# EasyEDA Pro project ProPrj_FOC_TEST_2025-02-24.epro, board PCB1
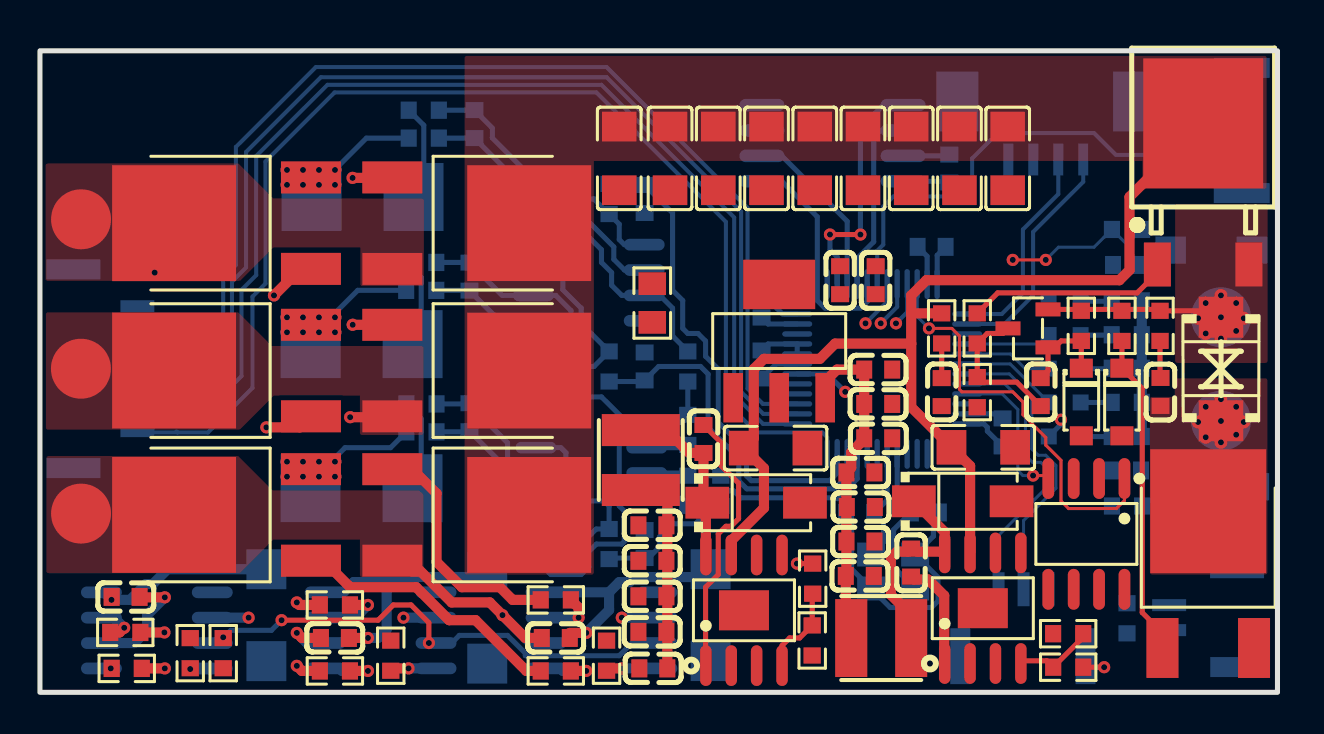
[diagram p6: board, top side]
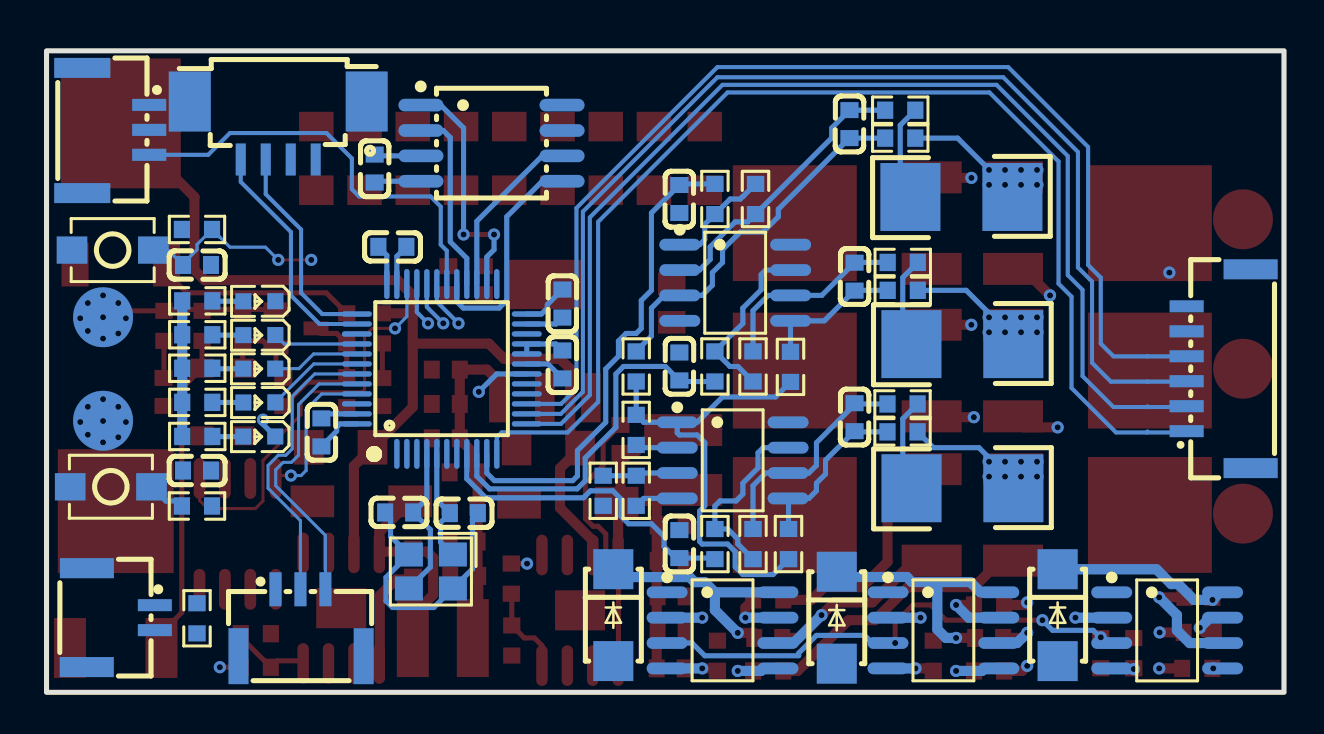
[diagram p7: board, bottom side, seen from below]

Outline 61.9 x 32.11 mm; copper layers: Top Layer, Inner1, Inner2, Bottom Layer. Coordinates in mm from the lower left corner of the outline.
Outline path: rectangle 0,32.11 61.9,0
Stack: Top Layer 0.035mm 外层铜厚1oz / Dielectric1 0.2104mm 7628 RC49% 8.6mil / Inner1 0.0152mm 内层铜厚 / Dielectric2 1.065mm 1.1mm H/HOZ 含铜 / Inner2 0.0152mm 内层铜厚 / Dielectric3 0.2104mm 7628 RC49% 8.6mil / Bottom Layer 0.035mm 外层铜厚1oz

## Design rules (mm)
template: 自定义配置
spacing copperThickness1oz (default): track to track 0.102, other pairs 0.152 to 0.3
spacing copperThickness2oz: track to track 0.203, other pairs 0.152 to 0.3
track width copperThickness1oz (default): min 0.127, default 0.254, max 5.08
track width copperThickness2oz: min 0.203, default 0.254, max 2.54
differential pair differentialPair (default): width min 0.127, default 0.254, max 2.54; gap min 0.152, default 0.152
via viaSize (default): diameter min 0.5, default 0.61, max 10; hole min 0.3, default 0.305, max 6.299

## Placement (name value [footprint] x y rotation side)
C9  100nF  [C0603]  41.93 16.15 0 top
C10  100nF  [C0603]  40.03 20.63 90 top
C11  10uF  [C0603]  41.93 14.43 0 top
C12  10uF  [C0603]  41.81 20.63 90 top
C13  10uF  [C1206]  47.19 12.26 180 top
C14  10uF  [C1206]  36.8 12.22 180 top
C15  10uF  [C0603]  30.68 1.2 0 top
C16  10uF  [C0603]  30.64 3.03 0 top
C17  10uF  [C0603]  30.64 4.8 0 top
C18  10uF  [C0603]  30.64 6.58 0 top
C19  10uF  [C0603]  30.64 8.36 0 top
C20  10uF  [C0603]  41.01 5.83 180 top
C21  10uF  [C0603]  41.04 7.55 180 top
C22  10uF  [C0603]  41.06 9.28 180 top
C23  10uF  [C0603]  41.04 11.01 180 top
C24  10uF  [C0603]  41.93 12.72 180 top
C28  100nF  [C0603]  54.38 21.39 0 bottom
C43  6pF  [C0603]  44.27 9 180 bottom
C44  100nF  [C0603]  44.61 22.3 0 bottom
C45  100nF  [C0603]  48.16 13.01 270 bottom
C48  6pF  [C0603]  41.03 8.97 0 bottom
C52  100nF  [C0603]  36.1 16.41 90 bottom
C54  100nF  [C0603]  54.38 11.1 0 bottom
C55  100nF  [C0603]  45.49 26.22 90 bottom
C56  4.7uF  [C0603]  25.8 2.72 0 top
C57  4.7uF  [C0603]  14.75 2.72 0 top
C58  4.7uF  [C0603]  4.28 4.77 180 top
C59  1uF  [C0603]  30.25 7.42 270 bottom
C60  1uF  [C0603]  30.25 16.31 270 bottom
C61  1uF  [C0603]  30.25 24.69 90 bottom
C62  47uF  [C1206]  48.41 26.72 90 top
C63  47uF  [C1206]  28.98 26.72 90 top
C64  47uF  [C1206]  31.52 26.72 90 top
C65  47uF  [C1206]  33.93 26.72 90 top
C66  47uF  [C1206]  36.34 26.72 90 top
C67  47uF  [C1206]  38.76 26.72 90 top
C68  47uF  [C1206]  41.17 26.72 90 top
C69  47uF  [C1206]  43.58 26.72 90 top
C70  47uF  [C1206]  46 26.72 90 top
C74  6pF  [C0603]  21.49 13.77 270 bottom
C75  6pF  [C0603]  21.49 20.81 270 bottom
C76  6pF  [C0603]  21.74 28.44 270 bottom
C78  1uF  [C0603]  45.11 15.03 270 top
C79  100nF  [C0603]  33.19 12.68 270 top
C80  100nF  [C0603]  43.58 6.49 90 top
C81  1uF  [C0603]  56.05 15.04 90 top
C82  100nF  [C0603]  50.06 15.03 270 top
C83  100nF  [C0603]  36.1 19.46 90 bottom
CN1  -  [CONN-SMD_1.25-4PWT]  50.31 28.12 180 bottom
D1  -  [SMB_L4.6-W3.6-LS5.3-BI]  59.08 16.18 90 top
D5  -  [SMA_L4.3-W2.5-LS5.0-FD]  46.16 9.56 180 top
D6  -  [DO-214AC_L4.3-W2.7-LS5.3-RD]  33.55 3.86 270 bottom
D7  -  [DO-214AC_L4.3-W2.7-LS5.3-RD]  22.37 3.73 270 bottom
D8  -  [DO-214AC_L4.3-W2.7-LS5.3-RD]  11.33 3.86 270 bottom
D9  -  [SMA_L4.3-W2.5-LS5.0-FD]  35.83 9.49 180 top
L2  15uH  [IND-SMD_L4.0-W4.0_FNR40XXS]  42.08 2.71 180 top
L3  15uH  [IND-SMD_L4.0-W4.0_FNR40XXS]  30.06 11.63 270 top
LED1  -  [LED_0603]  51.31 14.5 0 bottom
LED2  -  [LED_0603]  51.31 16.19 0 bottom
LED3  -  [LED_0603]  51.31 17.87 0 bottom
LED4  -  [LED_0603]  51.31 12.8 0 bottom
LED5  -  [LED_0603]  51.31 19.57 0 bottom
NOREF  -  [Pad_e4786]  2.05 8.94 0 top
NOREF#2  -  [Pad_e4785]  2.05 16.2 0 top
NOREF#3  -  [Pad_e793]  59.08 13.59 0 top
NOREF#4  -  [Pad_e4783]  2.05 23.68 0 top
NOREF#5  -  [Pad_e794]  59.08 18.77 0 top
Q3  -  [SOT-23-3_L2.9-W1.3-P1.90-LS2.4-BR]  49.43 18.22 0 top
Q5  -  [TO-252-2_L6.6-W6.1-P4.57-LS9.9-BR-CW]  58.44 5.64 270 top
Q6  -  [TO-252-2_L6.6-W6.1-P4.57-LS9.9-BR-CW]  21.05 8.88 180 top
Q7  -  [TO-252-2_L6.6-W6.1-P4.57-LS9.9-BR-CW]  21.05 16.1 180 top
Q8  -  [TO-252-2_L6.6-W6.1-P4.57-LS9.9-BR-CW]  21.05 23.48 180 top
Q9  -  [TO-252-2_L6.6-W6.1-P4.57-LS9.9-BR-CW]  10.13 8.88 0 top
Q10  -  [TO-252-2_L6.6-W6.1-P4.57-LS9.9-BR-CW]  10.13 16.1 0 top
Q11  -  [TO-252-2_L6.6-W6.1-P4.57-LS9.9-BR-CW]  10.13 23.48 0 top
Q13  IRFR5410TRPBF  [TO-252-2_L6.5-W6.1-P4.58-LS10.0-TR]  58.19 24.95 180 top
R1  22R  [R0603]  56.03 18.34 90 top
R4  22Ω  [R0603]  45.11 18.22 90 top
R13  10K  [R0603]  46.89 15.03 90 top
R15  0Ω  [R0805]  30.63 19.49 270 top
R19  12K  [R0603]  38.65 5.69 90 top
R20  5.1K  [R0603]  51.44 1.26 0 top
R21  1.5K  [R0603]  38.63 2.59 90 top
R22  1.5K  [R0603]  51.43 2.93 0 top
R30  120R  [R0603]  54.38 3.7 90 bottom
R31  10K  [R0603]  54.38 9.33 0 bottom
R32  10kΩ  [r0603]  54.38 23.17 0 bottom
R40  10K  [R0603]  34.06 10.09 270 bottom
R41  1K  [R0603]  19.08 14.43 180 bottom
R42  1K  [R0603]  19.08 13.04 180 bottom
R43  1K  [R0603]  19.07 21.52 180 bottom
R44  1K  [R0603]  19.07 20.12 180 bottom
R45  1K  [R0603]  19.2 29.14 180 bottom
R46  1K  [R0603]  19.2 27.74 180 bottom
R47  10R  [R0603]  14.75 4.37 180 top
R48  0R  [R0603]  17.55 1.83 270 top
R49  10R  [R0603]  14.75 1.07 180 top
R50  10K  [R0603]  32.41 10.09 90 bottom
R51  36.5K  [R0603]  26.57 7.42 90 bottom
R52  36.5K  [R0603]  24.79 7.42 90 bottom
R53  36.5K  [R0603]  26.57 16.31 90 bottom
R54  36.5K  [R0603]  24.69 16.29 90 bottom
R55  36.5K  [R0603]  26.44 24.69 270 bottom
R56  36.5K  [R0603]  32.41 16.31 90 bottom
R57  10K  [R0603]  32.41 13.14 90 bottom
R59  100R  [R0603]  28.47 7.42 90 bottom
R60  100R  [R0603]  28.47 16.31 90 bottom
R61  100R  [R0603]  28.47 24.69 270 bottom
R62  10R  [R0603]  4.27 3 0 top
R63  0R  [R0603]  7.52 1.96 270 top
R64  10R  [R0603]  4.34 1.2 0 top
R65  10K  [R0603]  9.17 1.96 90 top
R155  10K  [R0603]  54.37 14.51 180 bottom
R156  10K  [R0603]  54.37 16.22 180 bottom
R157  10K  [R0603]  54.37 17.9 180 bottom
R158  10K  [R0603]  54.37 12.81 180 bottom
R159  10K  [R0603]  54.37 19.59 180 bottom
R160  10R  [R0603]  25.8 4.63 180 top
R161  10R  [R0603]  25.8 1.07 180 top
R162  2mΩ  [RES-SMD_L6.4-W3.2-A]  16.09 10.21 180 bottom
R163  2mΩ  [RES-SMD_L6.4-W3.2-A]  16.09 17.43 180 bottom
R164  2mΩ  [RES-SMD_L6.4-W3.2-A]  16.14 24.79 180 bottom
R165  0R  [R0603]  28.34 1.83 270 top
R166  100K  [R0603]  54.12 18.34 90 top
R167  100K  [R0603]  52.09 18.34 90 top
R168  1K  [R0603]  46.89 18.22 90 top
SW3  轻触按键3*4*H  [SW-SMD_L4.0-W2.9-LS5.0]  58.6 22.14 0 bottom
SW4  轻触按键3*4*H  [SW-SMD_L4.0-W2.9-LS5.0]  58.69 10.29 180 bottom
U3  -  [SOIC-8_L5.0-W4.0-P1.27-LS6.0-BL-EP2.0]  35.22 4.1 0 top
U4  -  [SOIC-8_L5.0-W4.0-P1.27-LS6.0-BL-EP2.0]  47.16 4.21 0 top
U5  -  [SOT-223-4_L6.5-W3.5-P2.30-LS7.0-BR]  36.98 17.58 270 top
U12  -  [LQFP-48_L7.0-W7.0-P0.50-LS9.0-BL]  42.13 16.19 180 bottom
U13  -  [CONN-SMD_6P-P1.25_GH1.25-6PWBPZ]  3.27 16.2 90 bottom
U17  SN65HVD230DR  [SOIC-8_L4.9-W3.9-P1.27-LS6.0-BL]  52.35 7.93 180 top
U18  -  [SOIC-8_L5.2-W5.2-P1.27-LS7.9-BL]  39.65 27.49 270 bottom
U19  -  [SOIC-8_L4.9-W3.9-P1.27-LS6.0-BL]  27.45 20.5 270 bottom
U20  -  [SOIC-8_L4.9-W3.9-P1.27-LS6.0-BL]  28.09 3.1 270 bottom
U21  -  [SOIC-8_L4.9-W3.9-P1.27-LS6.0-BL]  17.04 3.1 270 bottom
U22  -  [SOIC-8_L4.9-W3.9-P1.27-LS6.0-BL]  5.85 3.1 270 bottom
U23  -  [SOIC-8_L4.9-W3.9-P1.27-LS6.0-BL]  27.58 11.61 270 bottom
U24  GH1.25-2P卧贴  [CONN-SMD_2P-P1.25_GH1.25-2PWBPZ]  58.19 3.74 270 bottom
U25  GH1.25-3P卧贴  [CONN-SMD_GH1.25-3P]  49.17 3.48 180 bottom
U26  GH1.25-3P卧贴  [CONN-SMD_GH1.25-3P]  58.44 28.12 270 bottom
X1  8MHz  [CRYSTAL-SMD_4P-L3.2-W2.5-BL]  42.68 6.05 0 bottom
ZD1  MMSZ5239B  [SOD-123_L2.8-W1.8-LS3.7-RD]  54.12 14.53 270 top
ZD2  MMSZ5239B  [SOD-123_L2.8-W1.8-LS3.7-RD]  52.09 14.53 270 top

## Footprints (pads in the part's own frame, mm; a bottom-side part is the same pattern mirrored in y, then rotated)
C0603
  rect 0.8x0.9 smd: 1(-0.7,0) 2(0.7,0)
C1206
  rect 1.485x1.728 smd: 1(-1.593,0) 2(1.593,0)
CONN-SMD_1.25-4PWT
  rect 0.5x1.6 smd: 1(1.875,-1.45) 2(0.625,-1.45) 3(-0.625,-1.45) 4(-1.875,-1.45)
  rect 2.1x2.999 smd: 5(4.425,1.45) 6(-4.425,1.45)
CONN-SMD_2P-P1.25_GH1.25-2PWBPZ
  rect 0.6x1.7 smd: 1(-0.625,1.702) 2(0.625,1.702)
  rect 1.001x2.7 smd: 3(-2.474,-1.696) 4(2.474,-1.702)
CONN-SMD_6P-P1.25_GH1.25-6PWBPZ
  rect 0.6x1.7 smd: 1(-3.125,1.6) 2(-1.875,1.6) 3(-0.625,1.6) 4(0.625,1.6) 5(1.875,1.6) 6(3.125,1.6)
  rect 1x2.7 smd: 7(-4.975,-1.6) 8(4.975,-1.6)
CONN-SMD_GH1.25-3P
  rect 0.6x1.7 smd: 1(-1.282,1.675) 2(-0.032,1.675) 3(1.218,1.675)
  rect 1x2.8 smd: 4(-3.132,-1.675) 5(3.132,-1.675)
CRYSTAL-SMD_4P-L3.2-W2.5-BL
  rect 1.4x1.2 smd: 1(-1.1,-0.85) 2(1.1,-0.85) 3(1.1,0.85) 4(-1.1,0.85)
DO-214AC_L4.3-W2.7-LS5.3-RD
  rect 1.999x1.999 smd: 1(-2.299,0) 2(2.301,0)
IND-SMD_L4.0-W4.0_FNR40XXS
  rect 1.6x3.9 smd: 1(-1.5,0) 2(1.5,0)
LED_0603
  rect 0.8x0.8 smd: 1(-0.851,-0.01) 2(0.75,-0.005)
LQFP-48_L7.0-W7.0-P0.50-LS9.0-BL
  oval 0.27x1.5 smd: 2(-2.25,-4.25) 3(-1.75,-4.25) 4(-1.25,-4.25) 5(-0.75,-4.25) 6(-0.25,-4.25) 7(0.25,-4.25) 8(0.75,-4.25) 9(1.25,-4.25) 10(1.75,-4.25) 11(2.25,-4.25) 12(2.75,-4.25) 25(2.75,4.25) 26(2.25,4.25) 27(1.75,4.25) 28(1.25,4.25) 29(0.75,4.25) 30(0.25,4.25) 31(-0.25,4.25) 32(-0.75,4.25) 33(-1.25,4.25) 34(-1.75,4.25) 35(-2.25,4.25) 36(-2.75,4.25)
  oval 1.5x0.27 smd: 13(4.25,-2.75) 14(4.25,-2.25) 15(4.25,-1.75) 16(4.25,-1.25) 17(4.25,-0.75) 18(4.25,-0.25) 19(4.25,0.25) 20(4.25,0.75) 21(4.25,1.25) 22(4.25,1.75) 23(4.25,2.25) 24(4.25,2.75) 37(-4.25,2.75) 38(-4.25,2.25) 39(-4.25,1.75) 40(-4.25,1.25) 41(-4.25,0.75) 42(-4.25,0.25) 43(-4.25,-0.25) 44(-4.25,-0.75) 45(-4.25,-1.25) 46(-4.25,-1.75) 47(-4.25,-2.25) 48(-4.25,-2.75)
Pad_e793
  round 3 smd far side: 1(0,0)
Pad_e794
  round 3 smd far side: 1(0,0)
Pad_e4783
  round 3 smd: 1(0,0)
Pad_e4785
  round 3 smd: 1(0,0)
Pad_e4786
  round 3 smd: 1(0,0)
R0603
  rect 0.806x0.864 smd: 1(-0.753,0) 2(0.753,0)
r0603
  rect 0.806x0.864 smd: 1(-0.753,0) 2(0.753,0)
R0805
  rect 1.133x1.377 smd: 1(-0.966,0) 2(0.966,0)
RES-SMD_L6.4-W3.2-A
  rect 2.999x3.401 smd: 1(-2.55,0) 2(2.55,0)
SMA_L4.3-W2.5-LS5.0-FD
  rect 2.184x1.593 smd: 1(-2.443,0) 2(2.443,0)
SMB_L4.6-W3.6-LS5.3-BI
  rect 2.047x2.24 smd: 1(-2.591,0) 2(2.591,0)
SOD-123_L2.8-W1.8-LS3.7-RD
  rect 0.95x1.15 smd: 1(-1.692,0) 2(1.692,0)
SOIC-8_L4.9-W3.9-P1.27-LS6.0-BL
  oval 0.588x2.045 smd: 1(-1.905,-2.772) 2(-0.635,-2.772) 3(0.635,-2.772) 4(1.905,-2.772) 5(1.905,2.772) 6(0.635,2.772) 7(-0.635,2.772) 8(-1.905,2.772)
SOIC-8_L5.0-W4.0-P1.27-LS6.0-BL-EP2.0
  oval 0.574x2.037 smd: 1(-1.905,-2.768) 2(-0.635,-2.768) 3(0.635,-2.768) 4(1.905,-2.768) 5(1.905,2.768) 6(0.635,2.768) 7(-0.635,2.768) 8(-1.905,2.768)
  rect 2.5x2 smd: 9(0,0)
SOIC-8_L5.2-W5.2-P1.27-LS7.9-BL
  oval 0.63x2.25 smd: 1(-1.905,-3.53) 2(-0.635,-3.53) 3(0.635,-3.53) 4(1.905,-3.53) 5(1.905,3.53) 6(0.635,3.53) 7(-0.635,3.53) 8(-1.905,3.53)
SOT-23-3_L2.9-W1.3-P1.90-LS2.4-BR
  rect 1.25x0.701 smd: 1(1.001,-0.95) 2(1.001,0.95) 3(-1.001,0)
SOT-223-4_L6.5-W3.5-P2.30-LS7.0-BR
  rect 2.47x0.98 smd: 1(2.835,-2.3) 2(2.835,0) 3(2.835,2.3)
  rect 2.47x3.6 smd: 4(-2.835,0)
SW-SMD_L4.0-W2.9-LS5.0
  rect 1.53x1.36 smd: 1(-2.035,0) 2(2.035,0)
TO-252-2_L6.5-W6.1-P4.58-LS10.0-TR
  rect 1.35x2.2 smd: 1(2.29,3.533) 3(-2.29,3.533)
  rect 6x6.5 smd: 4(0,-3.533)
TO-252-2_L6.6-W6.1-P4.57-LS9.9-BR-CW
  rect 3x1.6 smd: 1(3.424,-2.29) 3(3.424,2.29)
  rect 6.2x5.8 smd: 2(-3.424,0)

## Nets
As in the schematic, except:
5V: C9.1 C11.1 C20.2 C21.2 C22.2 C23.2 C24.2 C54.1 L2.2 R20.2 U5.3 U17.3 U26.2
11V: C15.2 C16.2 C17.2 C18.2 C19.2 D6.2 D7.2 D8.2 L3.2 R19.2 U20.1 U21.1 U22.1
GROUND: C81.1 D1.1 NOREF#3.1 Q5.2
POWER: D1.2 NOREF#5.1 Q3.2 Q13.3 R1.2 R166.2 R167.2
U: C56.1 NOREF.1 Q6.3 Q9.2 U20.6
V: C57.1 NOREF#2.1 Q7.3 Q10.2 U21.6
W: C58.1 NOREF#4.1 Q8.3 Q11.2 U22.6
$2N13950: C80.2 D5.2 L2.1 U4.8
$2N13958: C79.2 D9.2 L3.1 U3.8

Pads without a net: U3 2 3 5; U4 2 3 5; U5 2; U12 2 3 4 8 16 17 39 46; U17 5

## Via types
v1: diameter 0.61, hole 0.305, Top Layer to Bottom Layer, 44 vias
v2: diameter 0.65, hole 0.3, Top Layer to Bottom Layer, 42 vias

## Routing (per net, layer and track width the routed paths; a pad name or vN(x,y) marks a point on that pad's centre or on a via; arc(x,y) is an arc through that point)
3.3V: length 18.3
  Bottom Layer w0.254: U12.36 44.88,21.87 C44.2 ; C45.2 47.39,13.07 47.39,13.26 47.22,13.44 U12.48 ; U12.24 37.15,18.94 36.85,19.23 36.85,19.41 C83.2 ; U12.20 U12.21 36.42,17.44 C52.2 ; U18.3 45.42,26.85 C55.2
  Bottom Layer w0.508: R158.1 55.12,12.81 55.12,19.59 R159.1
5V: length 18
  Top Layer w0.254: 52.19,1.26 v1(53.24,1.26)
  Top Layer w0.508: U5.3 39.28,15.56 39.87,16.15 C9.1 C11.1 C24.2 41.23,12.67 40.58,12.01 40.58,11.24 C23.2 C21.2 40.34,5.86 C20.2 40.31,2.99 L2.2
5V-FD: length 4.1
  Top Layer w0.254: R22.2 52.19,2.76 R20.1 50.36,1.58 49.21,1.58 U4.4
11V: length 11
  Top Layer w0.254: R19.2 v1(37.87,6.44)
  Top Layer w0.508: 31.39,9.2 31.39,10.13 30.06,10.13 ; C15.2 31.38,9.19
12V-FD: length 4.5
  Top Layer w0.254: R19.1 38.63,4.91 R21.2 38,2.72 37.5,2.72 37.12,2.34 U3.4
24V-CALC-OUT: length 55
  Top Layer w0.508: R4.2 43.6,18.97 43.58,18.99 ; 43.58,17.45 43.58,18.99 ; 43.58,17.45 39.77,17.45 39.01,16.69 36.22,16.69 35.71,16.18 35.71,12.73 C14.2 36.22,11.21 36.22,9.23 34.58,7.59 U3.7 ; 43.58,17.45 43.58,14.28 C13.2 46.53,11.33 U4.7 ; 43.58,18.99 43.58,19.87 44.35,20.63 54,20.63 54.51,21.14 54.51,24.8 Q13.4
AGND: length 2.2
  Bottom Layer w0.254: R50.1 32.03,9.71 U23.4
V1: length 19.7
  Top Layer w0.508: v1(15.64,18.4) 17.62,18.4 ; v1(12.85,4.5) 12.98,4.37 R47.2
  Inner1 w0.508: v1(12.85,4.5) 13.61,4.5 15.64,6.53 15.64,11.76 14.37,13.03 14.37,16.11 15.64,17.38 v1(15.64,18.4)
V2: length 16.3
  Top Layer w0.508: R49.2 13.1,1.07 v1(12.85,1.32) ; v1(11.33,13.26) 13,13.26 Q10.1
  Inner1 w0.508: v1(11.33,13.26) 11.33,2.85 v1(12.85,1.32)
ADC-U: length 16.5
  Bottom Layer w0.254: U12.9 40.88,10.69 39.89,9.69 39.85,9.74 35.04,9.74 34.69,10.09 33.58,10.09 33.17,9.68 33.17,8.82 32.79,8.44 31.65,8.44 31.01,7.8 31.01,7.29 30.44,6.72 C59.2 28.52,6.72 R59.1
ADC-V: length 18.4
  Bottom Layer w0.254: U12.10 40.38,10.82 39.74,10.18 35.36,10.18 34.96,10.58 34.96,11.73 33.42,13.26 33.42,15.93 33.04,16.31 30.95,16.31 30.2,15.56 R60.1
ADC-W: length 24.5
  Bottom Layer w0.254: U12.11 39.88,10.98 39.5,10.6 35.58,10.6 35.35,10.83 35.35,12.1 33.93,13.52 33.93,16.18 33.3,16.82 33.3,17.58 32.92,17.96 32.41,17.96 32.15,18.22 32.15,19.61 31.65,20.12 31.65,24 C61.2 30.2,25.45 R61.1
D-GND: length 38
  Bottom Layer w0.254: C45.1 47.93,13.94 U12.47 ; 18.63,24.95 19.2,25.51 19.2,28.38 R45.2 ; R43.2 19.07,20.76 19.07,17.9 18.5,17.34 ; C43.1 44.7,8.73 44.7,7.81 X1.2 44.92,5.75 44.92,4.57 44.6,4.25 42.53,4.25 X1.4 40.6,6.18 40.6,8.7 C48.1 ; U18.4 45.42,25.58 C55.1 ; U12.19 36.83,16.44 C52.1 ; C44.1 44.38,21.82 U12.35 ; R41.2 19.07,13.69 19.07,10.71 18.57,10.21 ; C83.1 36.42,18.44 U12.23
FDCAN-RX: length 7.6
  Top Layer w0.152: v1(49.68,10.85) 50.29,10.85 U17.4
  Bottom Layer w0.152: U12.45 48.14,14.94 48.92,14.16 48.92,11.1 49.17,10.85 v1(49.68,10.85)
FDCAN-TX: length 20.6
  Top Layer w0.152: U17.1 54.25,9.6 53.85,9.2 51.46,9.2 51.08,9.58 51.08,11.61 50.31,12.37 50.31,12.75 49.17,13.9 49.17,14.53 48.66,15.04 46.12,15.04 46,15.17 46,17.83 45.62,18.22 v1(44.47,18.22)
  Bottom Layer w0.152: U12.34 43.88,18.81 v1(44.47,18.22)
GROUND:
  vias: v2(57.93,13.53) v2(58.32,14.29) v2(58.32,12.77) v2(59.08,14.67) v2(59.08,13.58) v2(59.08,12.51) v2(59.84,14.29) v2(59.84,12.89) v2(60.22,13.53)
I-VREF: length 23.4
  Bottom Layer w0.254: R54.1 25.44,14.79 28.09,14.79 29.36,13.52 U23.1 ; R56.1 R57.2 32.03,13.52 U23.1 ; U23.1 30.35,12.99 30.25,12.88 29.36,12.88 28.98,12.5 28.98,9.33 29.23,9.07 29.23,7.55 29.11,7.42 27.84,7.42 27.45,7.04 27.45,6.28 27.07,5.9 25.56,5.9 R52.1
LED0: length 4.9
  Bottom Layer w0.152: LED1.1 48.54,16.44 U12.42
LED1: length 4.4
  Bottom Layer w0.152: 50.46,16.2 49.28,16.2 48.55,16.94 U12.41
LED2: length 4.3
  Bottom Layer w0.152: LED3.1 50.01,17.44 U12.40
LED-WARNING: length 15.2
  Inner1 w0.254: v1(51.08,13.64) 41.68,13.64 v1(40.28,15.04)
  Bottom Layer w0.254: v1(51.08,13.64) 51.08,13.42 LED4.1 ; U12.18 39.39,15.94 v1(40.28,15.04)
MOTOR_CSN: length 25
  Top Layer w0.254: v1(12.09,3.61) 16.91,3.61 17.68,4.37 18.56,4.37 19.45,3.48 v1(19.45,2.47)
  Bottom Layer w0.254: U20.3 29.61,2.47 28.98,1.83 24.28,1.83 24.28,1.96 23.39,2.85 20.98,2.85 20.6,2.47 U21.3 ; v1(12.09,3.61) 11.58,3.1 9.55,3.1 9.2,2.75 v1(9.17,2.75)
  Bottom Layer w0.508: 9.17,2.72 8.91,2.46 U22.3
NRST: length 9.8
  Top Layer w0.152: v1(48.66,21.64) v1(50.31,21.64)
  Bottom Layer w0.152: v1(50.31,21.64) 50.95,22.28 52.73,22.28 53.24,22.79 53.24,22.79 R32.1 54.38,22.41 54.38,22.15 55.08,21.45 C28.2 55.82,22.14 SW3.1
OSC+: length 7.8
  Bottom Layer w0.254: U12.5 42.88,9.69 C43.2 42.7,8.14 42.7,6.27 X1.3
OSC-: length 5.8
  Bottom Layer w0.254: U12.6 42.38,9.62 41.73,8.97 42.2,8.5 42.2,7.52 X1.1
POWER: length 8.8
  Top Layer w0.254: Q3.2 55.96,19.17 R1.2 58.76,19.1 v2(59.08,18.77)
  vias: v2(57.93,18.72) v2(58.32,19.49) v2(58.32,17.96) v2(59.08,19.87) v2(59.08,17.71) v2(59.84,19.49) v2(59.84,18.09) v2(60.22,18.72)
PWM-U: length 29.6
  Inner1 w0.508: v1(29.11,3.74) 29.11,12.75 33.04,16.69 41.93,16.69 42.82,17.58 v1(42.82,18.47)
  Bottom Layer w0.203: U12.33 43.38,19.03 v1(42.82,18.47)
  Bottom Layer w0.508: U20.2 v1(29.11,3.74)
PWM-V: length 36.7
  Inner1 w0.508: v1(42.06,18.47) 42.06,17.91 41.6,17.45 32.53,17.45 28.25,13.17 28.25,9.99 26.44,8.18 21.61,8.18 18.18,4.75 v1(18.18,3.74)
  Bottom Layer w0.203: U12.32 42.88,19.29 v1(42.06,18.47)
  Bottom Layer w0.508: v1(18.18,3.74) U21.2
PWM-W: length 48
  Inner1 w0.508: v1(10.44,3.74) 10.44,2.34 12.21,0.56 13.87,0.56 14.63,1.32 14.63,2.47 15.64,3.48 16.79,3.48 17.39,4.08 17.39,5.48 21.01,9.11 25.84,9.11 27.2,10.47 27.2,13.64 32.03,18.47 v1(41.3,18.47)
  Bottom Layer w0.203: U12.31 42.38,19.55 v1(41.3,18.47)
  Bottom Layer w0.508: v1(10.44,3.74) 10.43,3.73 U22.2
SPI1-CLK: length 58
  Bottom Layer w0.203: U12.13 36.17,13.44 34.73,14.88 34.73,23.77 28.09,30.41 14.38,30.41 10.82,26.84 10.82,20.88 10.08,20.14 10.08,15.83 8.53,14.28 6.86,14.28 ; U13.2 4.91,14.28 6.86,14.28 ; 6.86,14.28 6.83,14.31
SPI1-CSN: length 61.2
  Bottom Layer w0.203: U13.1 4.93,13.01 6.88,13.01 ; U12.12 39.38,12.77 39.14,13.01 35.84,13.01 34.31,14.53 34.31,23.55 27.84,30.03 14.74,30.03 11.28,26.57 11.28,20.46 10.63,19.81 10.63,15.23 8.4,13.01 6.88,13.01 ; 6.83,13.06 6.88,13.01
SPI1-MISO: length 57.4
  Bottom Layer w0.203: 6.84,15.55 8.66,15.55 9.6,16.49 9.6,20.56 10.31,21.26 10.31,27.05 14.05,30.79 28.34,30.79 35.07,24.06 35.07,15.04 36.18,13.94 U12.14 ; 6.84,15.55 6.83,15.56 ; 6.84,15.55 4.89,15.55 U13.3
SPI1-MOSI: length 56.7
  Bottom Layer w0.203: U13.4 4.87,16.82 6.84,16.82 ; 6.84,16.82 8.53,16.82 9.17,17.45 9.17,20.76 9.8,21.39 9.8,27.3 13.8,31.3 28.34,31.3 35.4,24.24 35.4,15.2 36.17,14.44 U12.15 ; 6.84,16.82 6.83,16.81
SPI2-CLK: length 8.8
  Bottom Layer w0.254: U18.6 37.11,26.85 40.38,23.58 U12.27
SPI2-CSN: length 12.1
  Top Layer w0.254: v1(39.52,22.91) v1(41.04,22.91)
  Bottom Layer w0.254: U18.1 42.19,29.39 41.04,28.25 v1(41.04,22.91) ; v1(39.52,22.91) 39.52,22.15 39.88,21.79 U12.26
SPI2-MISO: length 9.3
  Bottom Layer w0.254: U18.2 42.06,28.12 41.71,27.77 41.71,22.55 40.88,21.72 U12.28
SPI2-MOSI: length 11.4
  Bottom Layer w0.254: U12.29 41.38,19.56 41.05,19.23 39.27,19.23 38.88,19.61 38.88,23.8 37.11,25.58 U18.5
SWCLK: length 11.7
  Bottom Layer w0.203: U12.38 48.25,18.44 49.68,19.87 49.68,23.04 52.19,25.55 CN1.4
SWDIO: length 10.6
  Bottom Layer w0.203: U12.37 48.11,18.94 49.17,19.99 49.17,23.17 50.94,24.94 CN1.3
TIM1-CH1: length 21.5
  Bottom Layer w0.203: U12.30 41.88,22.1 42.19,22.41 42.19,24.31 42.69,24.82 46.27,24.82 46.63,25.19 46.63,26.72 47.9,27.99 52.73,27.99 53.82,26.9 56.77,26.9
U: length 11.9
  Top Layer w0.508: C56.1 24.28,2.72 v1(23.14,3.86) 22.5,4.5 20.6,4.5 18.25,6.84 17.63,6.84
  Bottom Layer w0.508: v1(23.14,3.86) 24.53,2.47 U20.6
U1: length 12.2
  Top Layer w0.508: 17.63,11.42 18.37,11.42 19.83,9.96 19.83,6.53 21.1,5.26 23.01,5.26 23.64,4.63 R160.2
U2: length 13.8
  Top Layer w0.508: Q9.1 14.19,6.59 15.52,5.26 18.82,5.26 20.47,3.61 21.79,3.61 24.33,1.07 R161.2
USART1-RX: length 14.3
  Bottom Layer w0.152: U25.3 47.95,7.85 50.44,10.34 50.44,11.14 50.07,11.51 49.65,11.51 49.3,11.87 49.3,14.41 48.27,15.44 U12.44
USART1-TX: length 14.7
  Bottom Layer w0.152: U12.43 48.49,15.94 49.62,14.81 49.62,12.18 49.93,11.87 50.31,11.87 50.82,11.36 50.82,10.21 49.2,8.6 U25.2
V: length 18.4
  Top Layer w0.508: v1(12.85,2.98) 13.1,2.72 C57.1 ; Q7.3 17.58,13.77 v1(15.52,13.77)
  Inner1 w0.508: v1(15.52,13.77) 15.52,13.02 16.66,11.88 16.66,5.87 13.76,2.98 v1(12.85,2.98)
  Bottom Layer w0.508: v1(12.85,2.98) 13.36,2.47 U21.6
W: length 24.3
  Top Layer w0.508: v1(6.25,4.75) 5.01,4.75 C58.1
  Inner1 w0.508: v1(5.74,21.01) 6.25,21.01 8.28,18.98 8.28,6.79 v1(6.25,4.75)
  Bottom Layer w0.508: U22.6 4.72,2.46 5.36,3.1 5.36,3.86 v1(6.25,4.75)
W1: length 31.7
  Top Layer w0.508: R62.2 v1(6.22,3) ; Q8.1 17.6,25.75 v1(15.64,25.75)
  Inner1 w0.508: v1(6.22,3) 9.17,5.94 9.17,19.23 11.58,21.64 14.75,21.64 15.64,22.53 v1(15.64,25.75)
W2: length 24.5
  Top Layer w0.508: R64.2 v1(6.25,1.2) ; Q11.1 13.03,21.19 v1(11.71,19.87)
  Inner1 w0.508: v1(11.71,19.87) 10.06,18.22 10.06,5.01 v1(6.25,1.2)
$1N6953: length 1.6
  Bottom Layer w0.254: LED1.2 53.61,14.51 R155.2
$1N6979: length 1.6
  Bottom Layer w0.254: LED2.2 53.59,16.2 R156.2
$1N7005: length 1.6
  Bottom Layer w0.254: LED3.2 53.59,17.88 R157.2
$1N7093: length 1.6
  Bottom Layer w0.254: R158.2 53.61,12.8 LED4.2
$1N7148: length 1.6
  Bottom Layer w0.254: LED5.2 53.59,19.57 R159.2
$1N7337: length 1.9
  Bottom Layer w0.254: SW4.2 55.94,9.58 55.39,9.58 R31.2
$2N12458: length 1.7
  Top Layer w0.254: R4.1 C78.1
$2N13942: length 5.5
  Top Layer w0.508: U4.1 45.23,1.46 45.23,4.84 44.43,5.65 43.72,5.65 C80.1
$2N13950: length 10.6
  Top Layer w0.508: D5.2 45.26,8.02 U4.8 45.2,7.04 43.92,7.04 43.77,7.19 C80.2 43.43,7.05 42.87,7.05 42.57,6.74 42.57,4.88 43.58,3.86 L2.1
$2N13955: length 13.6
  Top Layer w0.254: C79.1 34.06,12.51 34.06,11.36 34.95,10.47 34.95,8.69 34.57,8.31 34.31,8.31 33.93,7.93 33.93,5.9 33.3,5.26 33.3,1.35 U3.1
$2N13958: length 8.8
  Top Layer w0.508: L3.1 31.34,13.13 32.49,11.98 C79.2 33.19,9.68 D9.2 33.31,9.42 U3.8
$2N15647: length 1.9
  Top Layer w0.254: C81.2 56.03,15.76 R1.1
$2N15648: length 16.2
  Top Layer w0.254: Q5.1 56.15,2.98 55.14,3.99 55.14,15.21 ZD1.1 R166.1
$2N15651: length 7.3
  Top Layer w0.254: Q3.3 48.17,17.96 47.39,17.96 R168.1 46.89,15.78 47.14,15.53 48.86,15.53 C82.2
$2N15656: length 10.3
  Top Layer w0.254: R168.2 47.91,19.99 54.89,19.99 55.9,21.01 Q13.1
$2N15879: length 4.9
  Top Layer w0.254: C82.1 50.43,16.09 Q3.1 50.76,17.27 51.08,17.59 R167.1 ZD2.1
$3N2085: length 6.2
  Bottom Layer w0.254: R42.2 17.54,12.25 15.26,12.25 13.47,10.46 13.47,10.21
  vias: v2(12.36,11.54) v2(12.36,10.8) v2(13.16,11.54) v2(13.16,10.8) v2(13.96,11.54) v2(13.96,10.8) v2(14.76,11.54) v2(14.76,10.8)
$3N2087: length 6.8
  Bottom Layer w0.254: 13.4,24.31 13.4,24.82 16.33,27.74 R46.2
  vias: v2(12.36,26.15) v2(12.36,25.4) v2(13.16,26.15) v2(13.16,25.4) v2(13.96,26.15) v2(13.96,25.4) v2(14.76,26.15) v2(14.76,25.4)
$3N2102: length 2.7
  Top Layer w0.508: R160.1 26.95,4.24 v1(26.95,3.74)
  Bottom Layer w0.508: v1(26.95,3.74) U20.7
$3N2107: length 2.9
  Top Layer w0.508: v1(27.33,1.07) 26.68,1.07 26.56,1.2
  Bottom Layer w0.508: v1(27.33,1.07) 26.16,1.07 26.04,1.2 U20.5
$3N2110: length 3.3
  Top Layer w0.508: R47.1 15.51,4.38 15.52,4.37 v1(16.41,4.37)
  Bottom Layer w0.508: U21.7 15.77,3.74 v1(16.41,4.37)
$3N2115: length 3.1
  Top Layer w0.508: R49.1 v1(16.41,1.07)
  Bottom Layer w0.508: U21.5 14.99,1.2 15.11,1.07 v1(16.41,1.07)
$3N2118: length 2.1
  Top Layer w0.508: R62.1 3.98,3 4.21,3.23
  Bottom Layer w0.508: v1(4.21,3.23) 3.71,3.73 U22.7
$3N2123:
  vias: v1(3.54,1.2)
$3N2134: length 9
  Bottom Layer w0.508: U22.8 3.2,5 v1(3.58,4.63) 4.5,4.63 5.29,5.42 5.64,5.42 6.38,6.16 D8.1
$3N2135: length 13.1
  Top Layer w0.508: v1(16.41,2.72) C57.2
  Bottom Layer w0.508: 17.34,5.52 17.34,3.15 16.91,2.72 v1(16.41,2.72) ; 17.34,5.52 18.61,5.52 18.87,5.77 22.3,5.77 22.68,6.15 ; 17.34,5.52 15.69,5.52 15.19,5.01 14.45,5.01
$3N2136: length 12
  Top Layer w0.508: v1(27.33,2.98) 26.5,2.98
  Bottom Layer w0.508: v1(27.33,2.98) 28.47,4.12 28.47,5.01 ; 33.55,6.15 33.17,5.77 29.74,5.77 29.49,5.52 28.98,5.52 28.47,5.01 ; 28.47,5.01 U20.8
$3N2146: length 6.2
  Bottom Layer w0.254: 13.4,17.34 13.4,17.63 15.9,20.12 R44.2
  vias: v2(12.36,18.77) v2(12.36,18.02) v2(13.16,18.77) v2(13.16,18.02) v2(13.96,18.77) v2(13.96,18.02) v2(14.76,18.77) v2(14.76,18.02)
$3N2147: length 7
  Bottom Layer w0.254: R54.2 24.69,18.59 U19.5 22.99,18.6 C75.2 21.47,20.12 R44.1
$3N2148: length 18.7
  Bottom Layer w0.254: R56.2 32.41,17.07 31.65,17.83 31.65,19.23 31.01,19.87 U19.3 29.11,19.87 28.6,20.37 28.6,21.01 28.09,21.52 28.09,22.15 27.2,23.04 26.06,23.04 25.3,23.8 25.3,24.18 21.74,27.74 R46.1
$3N2149: length 8.6
  Bottom Layer w0.254: R52.2 24.79,9.68 U23.5 23.77,9.71 23.39,10.09 23.39,10.47 22.94,10.92 22.94,11.62 C74.2 21.45,13.04 R42.1
$3N2152: length 11.3
  Bottom Layer w0.254: R51.2 26.57,10.34 25.93,10.98 U23.6 23.77,10.98 23.39,11.36 23.39,12.49 21.45,14.43 R41.1
$3N2153: length 9.8
  Bottom Layer w0.254: R43.1 21.47,21.52 C75.1 23.12,19.87 U19.6 25.8,19.87 26.57,19.1 R53.2
$3N2154: length 14.3
  Bottom Layer w0.254: 21.74,29.14 C76.1 ; 21.74,29.14 R45.1 ; 21.74,29.14 22.63,28.24 22.63,27.75 R55.2 26.83,23.55 27.45,23.55 28.71,22.3 28.71,21.67 29.24,21.14 U19.2
$3N2156: length 2.6
  Top Layer w0.508: R165.2 28.46,1.2 v1(29.11,1.2)
  Bottom Layer w0.508: v1(29.11,1.2) U20.4
$3N2159: length 2.3
  Top Layer w0.508: v1(18.44,1.2) 17.67,1.2 R48.2
  Bottom Layer w0.508: U21.4 v1(18.44,1.2)
$3N2161: length 1.1
  Bottom Layer w0.508: U22.4 8.59,1.16 v1(7.52,1.16)
$3N2163: length 2.1
  Bottom Layer w0.254: R57.1 32.27,12.25 U23.2
$3N2166: length 3.8
  Bottom Layer w0.254: R40.1 R50.2 32.27,10.98 U23.3
$3N2167: length 9.5
  Bottom Layer w0.254: U23.7 26.06,12.25 26.31,11.99 26.31,11.23 27.07,10.47 27.07,9.92 27.41,9.58 28.22,9.58 28.47,9.33 R59.2 27.83,8.17 27.33,7.67 27.33,7.43 R51.1
$3N2168: length 8.9
  Bottom Layer w0.254: R53.1 27.32,16.31 27.72,16.31 R60.2 27.07,18.46 27.07,19.23 26.15,20.15 26.15,20.91 25.93,21.14 U19.7
$3N2169: length 5.5
  Bottom Layer w0.254: R55.1 27.06,24.82 27.07,24.82 27.2,24.69 27.71,24.69 28.46,23.94 R61.2 28.98,23.43 28.98,22.66 29.23,22.41 U19.1

## Copper pours and planes (outline as drawn; the poured copper is in the pictures)
24V-CALC-OUT on Top Layer: 61.36,25.2 61.36,31.96 21.24,31.96 21.24,5.9 27.71,5.9 27.71,26.6 55.14,26.6 55.14,25.2
(no net) on Inner2: 2.16,31.85 61.65,31.85 61.65,0.26 2.16,0.26
GROUND on Top Layer: 56.76,15.72 61.4,15.72 61.4,5.9 55.5,5.9 55.5,14.79 56.76,14.79 56.76,14.79
POWER on Top Layer: 56.79,24.44 61.42,24.44 61.42,16.48 56.79,16.48
U on Top Layer: 0.32,11.83 9.91,11.83 11.63,10.12 19.18,10.12 19.18,5.69 16.01,5.69 16.01,7.65 11.68,7.65 9.99,5.96 0.32,5.96
V on Top Layer: 0.3,19.02 9.91,19.02 11.59,17.34 19.18,17.34 19.18,12.88 16.01,12.88 16.01,14.85 11.7,14.85 9.99,13.15 0.3,13.15
W on Top Layer: 0.28,26.47 9.93,26.47 11.68,24.72 19.2,24.72 19.2,20.33 16.02,20.33 16.02,22.27 11.67,22.27 10.01,20.6 0.28,20.6

Small or netless copper shapes (teardrops, artwork), in the pictures only: 14 on Inner2
